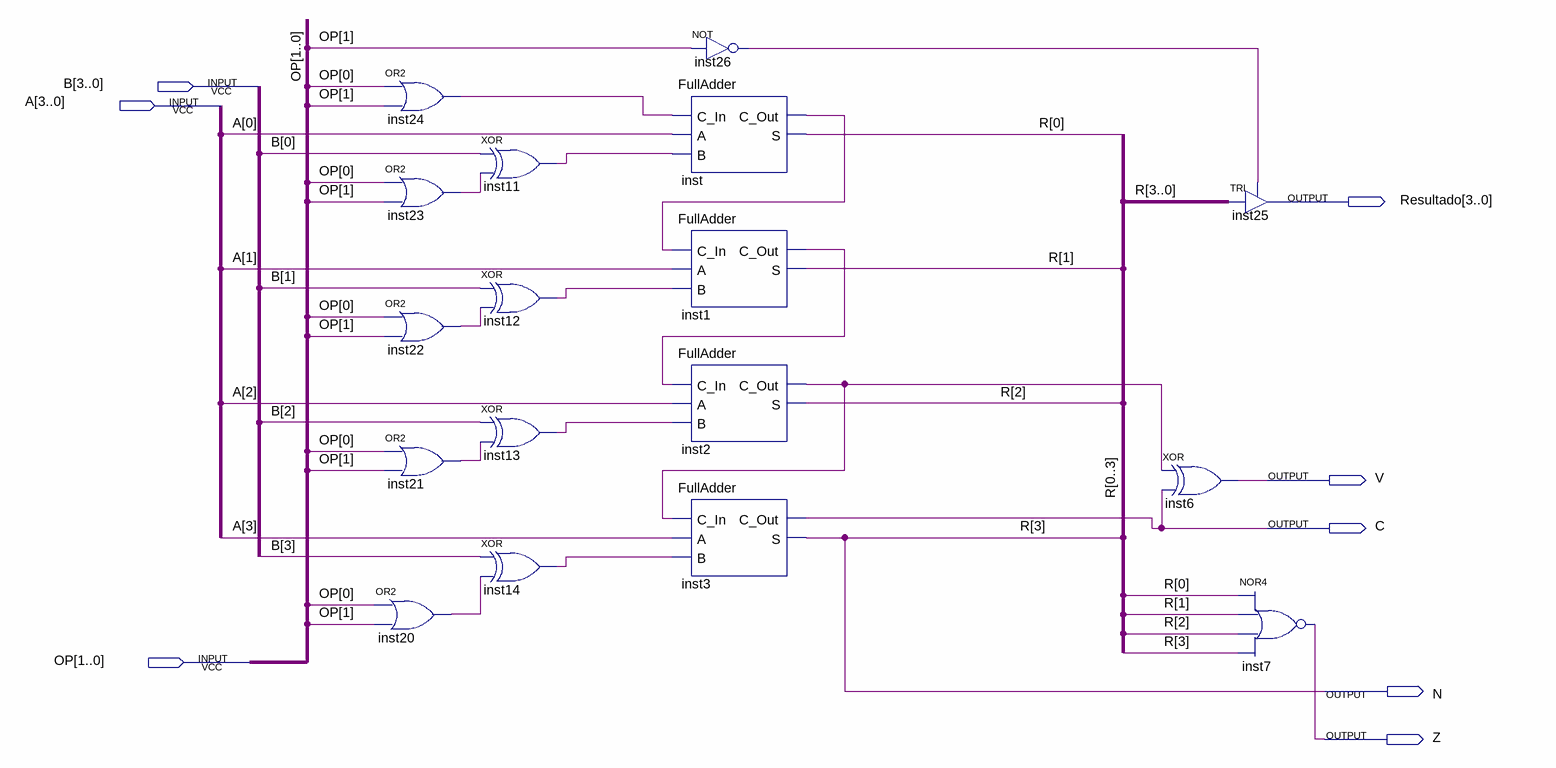
[diagram p0: schematic sheet]
// Quartus schematic MultiOperador.bdf as structural Verilog: 17 symbols, 8 pins
module MultiOperador (
  input  [3:0] B,
  input  [3:0] A,
  input  [1:0] OP,
  output [3:0] Resultado,
  output V,
  output C,
  output N,
  output Z
);

  wire inst1_c_out, inst2_c_out, inst11_out, inst12_out, inst13_out, inst14_out, inst20_out, inst21_out,
       inst22_out, inst23_out, inst24_out, inst26_out, inst_c_out;
  wire [2:0] R;

  or inst24 (inst24_out, OP[0], OP[1]);
  or inst23 (inst23_out, OP[0], OP[1]);
  or inst22 (inst22_out, OP[0], OP[1]);
  or inst21 (inst21_out, OP[0], OP[1]);
  or inst20 (inst20_out, OP[0], OP[1]);
  xor inst11 (inst11_out, B[0], inst23_out);
  xor inst12 (inst12_out, B[1], inst22_out);
  xor inst13 (inst13_out, B[2], inst21_out);
  xor inst14 (inst14_out, B[3], inst20_out);
  not inst26 (inst26_out, OP[1]);
  FullAdder inst (.C_In(inst24_out), .A(A[0]), .B(inst11_out), .C_Out(inst_c_out), .S(R[0]));
  FullAdder inst1 (.C_In(inst_c_out), .A(A[1]), .B(inst12_out), .C_Out(inst1_c_out), .S(R[1]));
  FullAdder inst2 (.C_In(inst1_c_out), .A(A[2]), .B(inst13_out), .C_Out(inst2_c_out), .S(R[2]));
  FullAdder inst3 (.C_In(inst2_c_out), .A(A[3]), .B(inst14_out), .C_Out(C), .S(N));
  xor inst6 (V, inst2_c_out, C);
  TRI inst25[3:0] (.IN({N, R}), .OE(inst26_out), .OUT(Resultado));
  nor inst7 (Z, R[0], R[1], R[2], N);

  // Other names for the same wires on the sheet: R[3] = N
endmodule
